# EAGLE design diff-probe (EAGLE 7.2.0)
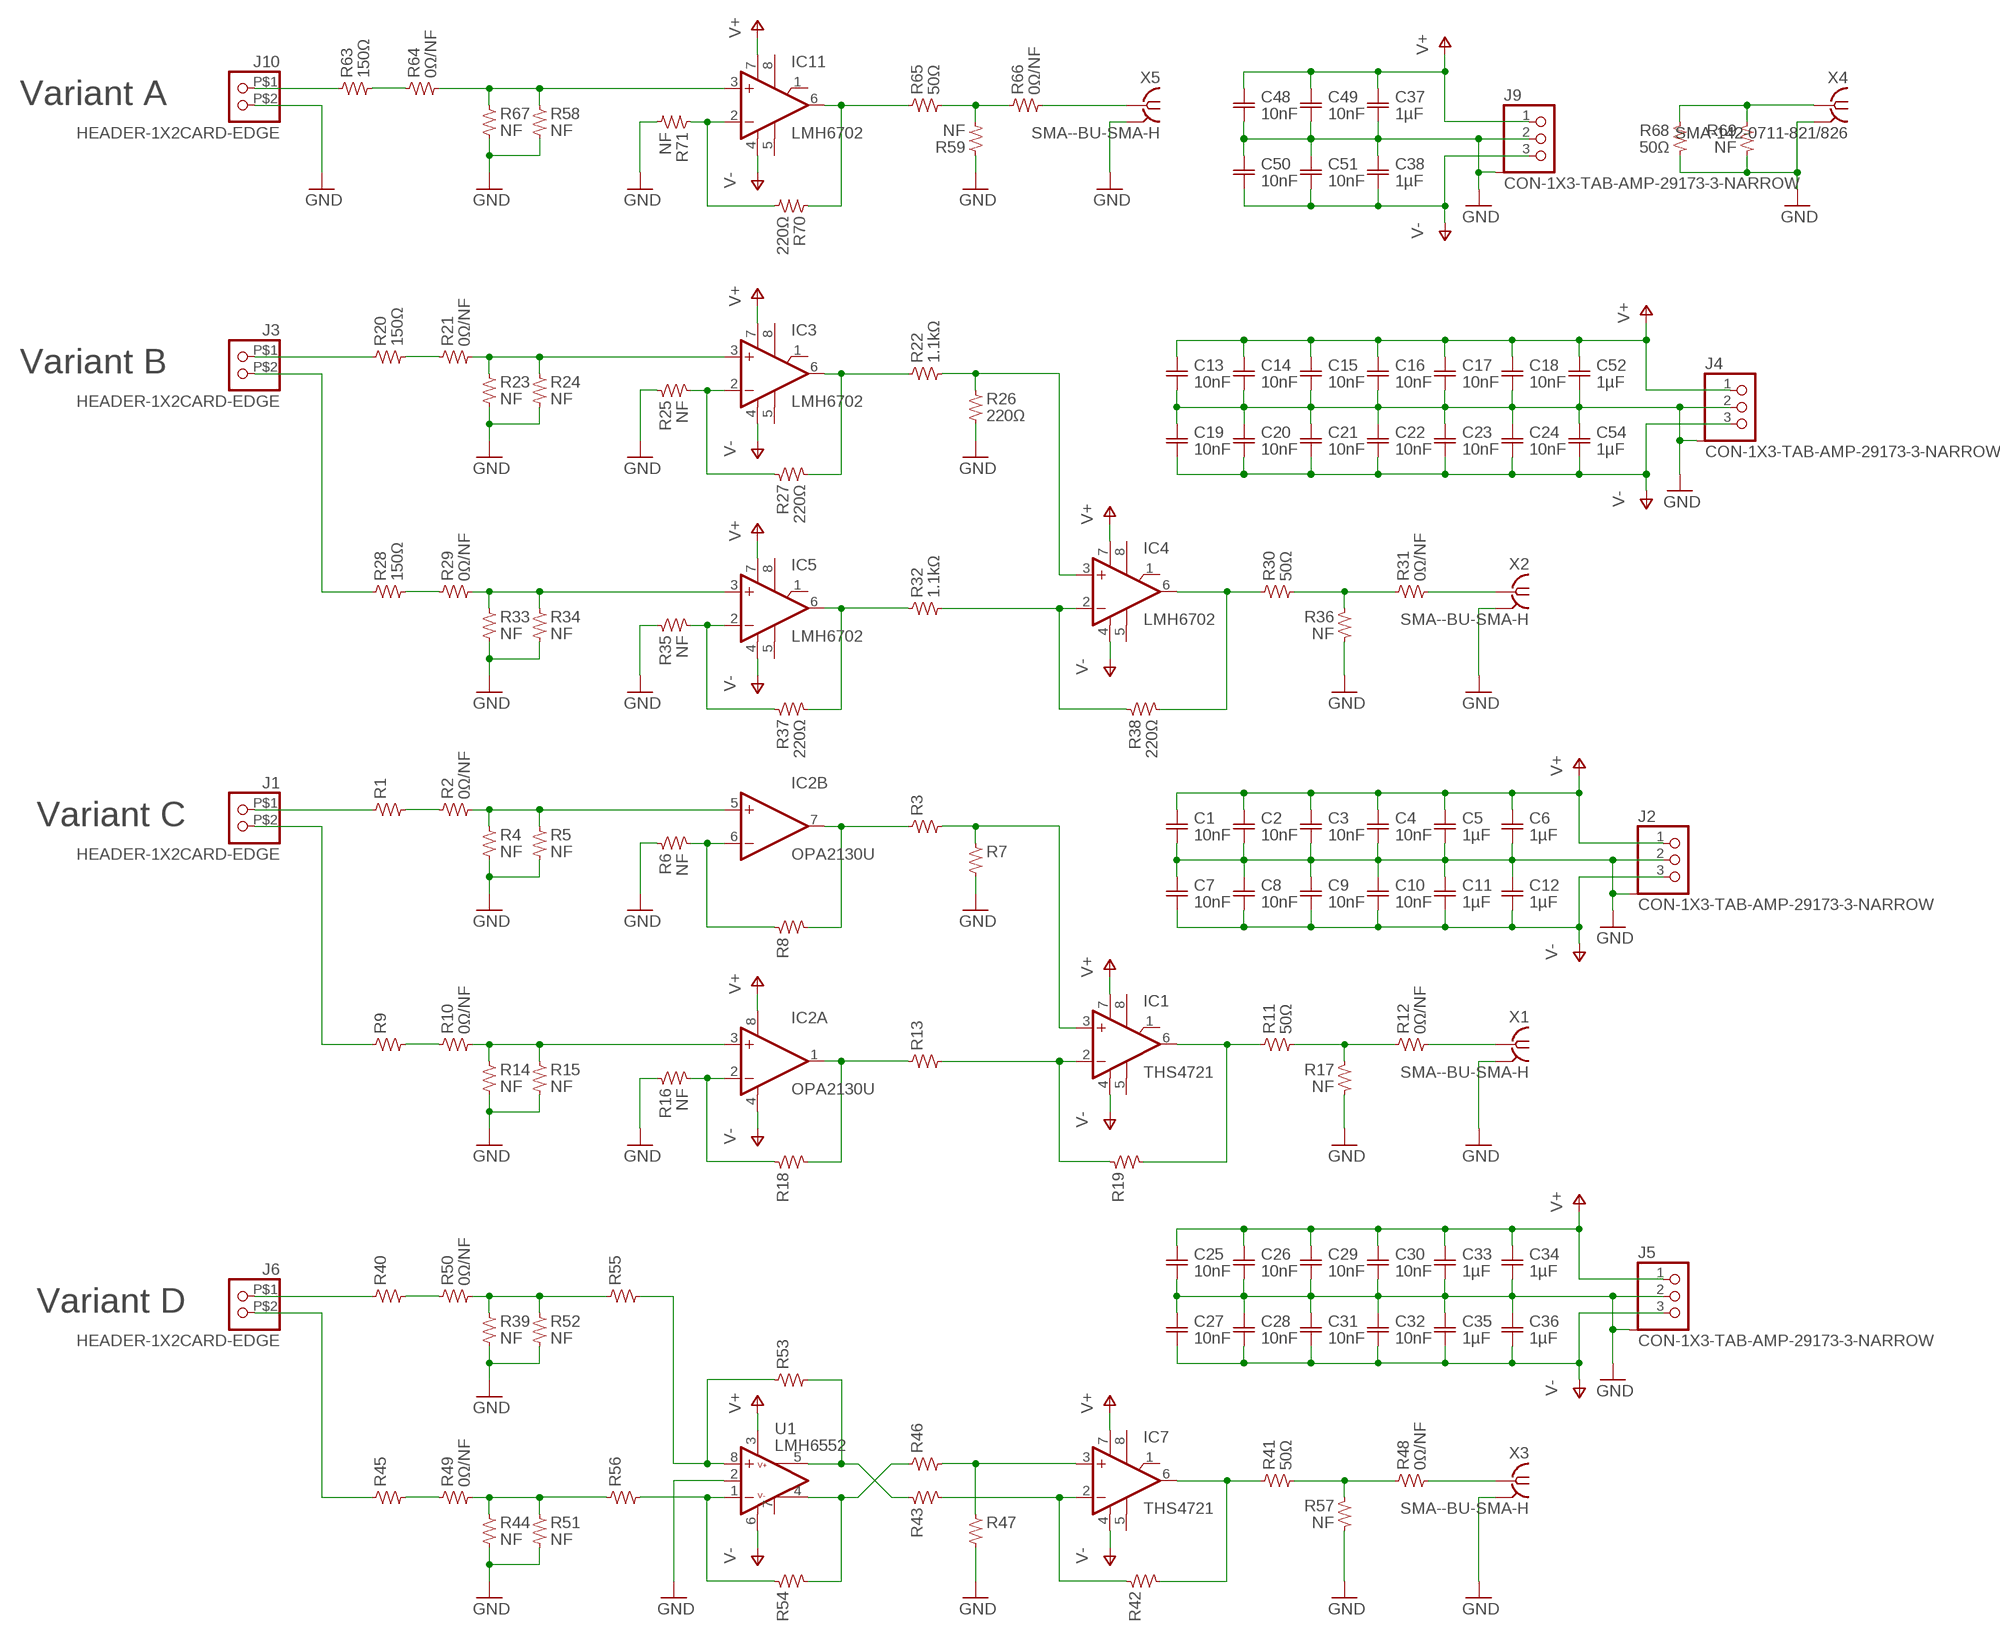
[diagram p0: schematic, sheet 1]

## Parts
C1  10nF  C-EU-0402-SQUARE  [0402-SQUARE]
C2  10nF  C-EU-0402-SQUARE  [0402-SQUARE]
C3  10nF  C-EU-0402-SQUARE  [0402-SQUARE]
C4  10nF  C-EU-0402-SQUARE  [0402-SQUARE]
C5  1µF  C-EU-0603-SQUARE  [0603-SQUARE]
C6  1µF  C-EU-0603-SQUARE  [0603-SQUARE]
C7  10nF  C-EU-0402-SQUARE  [0402-SQUARE]
C8  10nF  C-EU-0402-SQUARE  [0402-SQUARE]
C9  10nF  C-EU-0402-SQUARE  [0402-SQUARE]
C10  10nF  C-EU-0402-SQUARE  [0402-SQUARE]
C11  1µF  C-EU-0603-SQUARE  [0603-SQUARE]
C12  1µF  C-EU-0603-SQUARE  [0603-SQUARE]
C13  10nF  C-EU-0402-SQUARE  [0402-SQUARE]
C14  10nF  C-EU-0402-SQUARE  [0402-SQUARE]
C15  10nF  C-EU-0402-SQUARE  [0402-SQUARE]
C16  10nF  C-EU-0402-SQUARE  [0402-SQUARE]
C17  10nF  C-EU-0402-SQUARE  [0402-SQUARE]
C18  10nF  C-EU-0402-SQUARE  [0402-SQUARE]
C19  10nF  C-EU-0402-SQUARE  [0402-SQUARE]
C20  10nF  C-EU-0402-SQUARE  [0402-SQUARE]
C21  10nF  C-EU-0402-SQUARE  [0402-SQUARE]
C22  10nF  C-EU-0402-SQUARE  [0402-SQUARE]
C23  10nF  C-EU-0402-SQUARE  [0402-SQUARE]
C24  10nF  C-EU-0402-SQUARE  [0402-SQUARE]
C25  10nF  C-EU-0402-SQUARE  [0402-SQUARE]
C26  10nF  C-EU-0402-SQUARE  [0402-SQUARE]
C27  10nF  C-EU-0402-SQUARE  [0402-SQUARE]
C28  10nF  C-EU-0402-SQUARE  [0402-SQUARE]
C29  10nF  C-EU-0402-SQUARE  [0402-SQUARE]
C30  10nF  C-EU-0402-SQUARE  [0402-SQUARE]
C31  10nF  C-EU-0402-SQUARE  [0402-SQUARE]
C32  10nF  C-EU-0402-SQUARE  [0402-SQUARE]
C33  1µF  C-EU-0603-SQUARE  [0603-SQUARE]
C34  1µF  C-EU-0603-SQUARE  [0603-SQUARE]
C35  1µF  C-EU-0603-SQUARE  [0603-SQUARE]
C36  1µF  C-EU-0603-SQUARE  [0603-SQUARE]
C37  1µF  C-EU-0603-SQUARE  [0603-SQUARE]
C38  1µF  C-EU-0603-SQUARE  [0603-SQUARE]
C48  10nF  C-EU-0402-SQUARE  [0402-SQUARE]
C49  10nF  C-EU-0402-SQUARE  [0402-SQUARE]
C50  10nF  C-EU-0402-SQUARE  [0402-SQUARE]
C51  10nF  C-EU-0402-SQUARE  [0402-SQUARE]
C52  1µF  C-EU-0603  [0603]
C54  1µF  C-EU-0603  [0603]
IC1  THS4721  OP-AMP-8-TI  [SO08]
IC2  OPA2130U  [SO08]
IC3  LMH6702  OP-AMP-8-TI  [SO08]
IC4  LMH6702  OP-AMP-8-TI  [SO08]
IC5  LMH6702  OP-AMP-8-TI  [SO08]
IC7  THS4721  OP-AMP-8-TI  [SO08]
IC11  LMH6702  OP-AMP-8-TI  [SO08]
J1  HEADER-1X2CARD-EDGE  [CARD_EDGE_PADS-1X2]
J2  CON-1X3-TAB-AMP-29173-3-NARROW  [AMP-29173-3-NARROW]
J3  HEADER-1X2CARD-EDGE  [CARD_EDGE_PADS-1X2]
J4  CON-1X3-TAB-AMP-29173-3-NARROW  [AMP-29173-3-NARROW]
J5  CON-1X3-TAB-AMP-29173-3-NARROW  [AMP-29173-3-NARROW]
J6  HEADER-1X2CARD-EDGE  [CARD_EDGE_PADS-1X2]
J9  CON-1X3-TAB-AMP-29173-3-NARROW  [AMP-29173-3-NARROW]
J10  HEADER-1X2CARD-EDGE  [CARD_EDGE_PADS-1X2]
R1  R-US-0402-SQUARE  [0402-SQUARE]
R2  0Ω/NF  R-US-0402-SQUARE  [0402-SQUARE]
R3  R-US-0402-SQUARE  [0402-SQUARE]
R4  NF  R-US-0402-SQUARE  [0402-SQUARE]
R5  NF  R-US-0402-SQUARE  [0402-SQUARE]
R6  NF  R-US-0402-SQUARE  [0402-SQUARE]
R7  R-US-0402-SQUARE  [0402-SQUARE]
R8  R-US-0402-SQUARE  [0402-SQUARE]
R9  R-US-0402-SQUARE  [0402-SQUARE]
R10  0Ω/NF  R-US-0402-SQUARE  [0402-SQUARE]
R11  50Ω  R-US-0402-SQUARE  [0402-SQUARE]
R12  0Ω/NF  R-US-0402-SQUARE  [0402-SQUARE]
R13  R-US-0402-SQUARE  [0402-SQUARE]
R14  NF  R-US-0402-SQUARE  [0402-SQUARE]
R15  NF  R-US-0402-SQUARE  [0402-SQUARE]
R16  NF  R-US-0402-SQUARE  [0402-SQUARE]
R17  NF  R-US-0402-SQUARE  [0402-SQUARE]
R18  R-US-0402-SQUARE  [0402-SQUARE]
R19  R-US-0402-SQUARE  [0402-SQUARE]
R20  150Ω  R-US-0402-SQUARE  [0402-SQUARE]
R21  0Ω/NF  R-US-0402-SQUARE  [0402-SQUARE]
R22  1.1kΩ  R-US-0402-SQUARE  [0402-SQUARE]
R23  NF  R-US-0402-SQUARE  [0402-SQUARE]
R24  NF  R-US-0402-SQUARE  [0402-SQUARE]
R25  NF  R-US-0402-SQUARE  [0402-SQUARE]
R26  220Ω  R-US-0402-SQUARE  [0402-SQUARE]
R27  220Ω  R-US-0402-SQUARE  [0402-SQUARE]
R28  150Ω  R-US-0402-SQUARE  [0402-SQUARE]
R29  0Ω/NF  R-US-0402-SQUARE  [0402-SQUARE]
R30  50Ω  R-US-0402-SQUARE  [0402-SQUARE]
R31  0Ω/NF  R-US-0402-SQUARE  [0402-SQUARE]
R32  1.1kΩ  R-US-0402-SQUARE  [0402-SQUARE]
R33  NF  R-US-0402-SQUARE  [0402-SQUARE]
R34  NF  R-US-0402-SQUARE  [0402-SQUARE]
R35  NF  R-US-0402-SQUARE  [0402-SQUARE]
R36  NF  R-US-0402-SQUARE  [0402-SQUARE]
R37  220Ω  R-US-0402-SQUARE  [0402-SQUARE]
R38  220Ω  R-US-0402-SQUARE  [0402-SQUARE]
R39  NF  R-US-0402-SQUARE  [0402-SQUARE]
R40  R-US-0402-SQUARE  [0402-SQUARE]
R41  50Ω  R-US-0402-SQUARE  [0402-SQUARE]
R42  R-US-0402-SQUARE  [0402-SQUARE]
R43  R-US-0402-SQUARE  [0402-SQUARE]
R44  NF  R-US-0402-SQUARE  [0402-SQUARE]
R45  R-US-0402-SQUARE  [0402-SQUARE]
R46  R-US-0402-SQUARE  [0402-SQUARE]
R47  R-US-0402-SQUARE  [0402-SQUARE]
R48  0Ω/NF  R-US-0402-SQUARE  [0402-SQUARE]
R49  0Ω/NF  R-US-0402-SQUARE  [0402-SQUARE]
R50  0Ω/NF  R-US-0402-SQUARE  [0402-SQUARE]
R51  NF  R-US-0402-SQUARE  [0402-SQUARE]
R52  NF  R-US-0402-SQUARE  [0402-SQUARE]
R53  R-US-0402-SQUARE  [0402-SQUARE]
R54  R-US-0402-SQUARE  [0402-SQUARE]
R55  R-US-0402-SQUARE  [0402-SQUARE]
R56  R-US-0402-SQUARE  [0402-SQUARE]
R57  NF  R-US-0402-SQUARE  [0402-SQUARE]
R58  NF  R-US-0402-SQUARE  [0402-SQUARE]
R59  NF  R-US-0402-SQUARE  [0402-SQUARE]
R63  150Ω  R-US-0402-SQUARE  [0402-SQUARE]
R64  0Ω/NF  R-US-0402-SQUARE  [0402-SQUARE]
R65  50Ω  R-US-0402-SQUARE  [0402-SQUARE]
R66  0Ω/NF  R-US-0402-SQUARE  [0402-SQUARE]
R67  NF  R-US-0402-SQUARE  [0402-SQUARE]
R68  50Ω  R-US-0402-SQUARE  [0402-SQUARE]
R69  NF  R-US-0603-SQUARE  [0603-SQUARE]
R70  220Ω  R-US-0402-SQUARE  [0402-SQUARE]
R71  NF  R-US-0402-SQUARE  [0402-SQUARE]
U1  LMH6552  [SO08]
X1  SMA--BU-SMA-H  [BU-SMA-H]
X2  SMA--BU-SMA-H  [BU-SMA-H]
X3  SMA--BU-SMA-H  [BU-SMA-H]
X4  SMA-142-0711-821/826  [J502-ND-142-0711-821/826]
X5  SMA--BU-SMA-H  [BU-SMA-H]

## Nets
GND: C1.P$2 C2.P$2 C3.P$2 C4.P$2 C5.2 C6.2 C7.P$1 C8.P$1 C9.P$1 C10.P$1 C11.1 C12.1 C13.P$2 C14.P$2 C15.P$2 C16.P$2 C17.P$2 C18.P$2 C19.P$1 C20.P$1 C21.P$1 C22.P$1 C23.P$1 C24.P$1 C25.P$2 C26.P$2 C27.P$1 C28.P$1 C29.P$2 C30.P$2 C31.P$1 C32.P$1 C33.2 C34.2 C35.1 C36.1 C37.2 C38.1 C48.P$2 C49.P$2 C50.P$1 C51.P$1 C52.2 C54.1 J2.2 J2.P$4 J2.P$5 J4.2 J4.P$4 J4.P$5 J5.2 J5.P$4 J5.P$5 J9.2 J9.P$4 J9.P$5 J10.P$2 R4.P$2 R5.P$2 R6.P$1 R7.P$2 R14.P$2 R15.P$2 R16.P$1 R17.P$2 R23.P$2 R24.P$2 R25.P$1 R26.P$2 R33.P$2 R34.P$2 R35.P$1 R36.P$2 R39.P$2 R44.P$2 R47.P$2 R51.P$2 R52.P$2 R57.P$2 R58.P$2 R59.P$1 R67.P$2 R68.P$2 R69.2 R71.P$2 U1.2(VCM) X1.2 X1.3 X1.4 X1.5 X2.2 X2.3 X2.4 X2.5 X3.2 X3.3 X3.4 X3.5 X4.G@1 X4.G@2 X4.G@3 X4.G@4 X5.2 X5.3 X5.4 X5.5
N$1: IC11.3(+IN) R58.P$1 R64.P$2 R67.P$1
N$2: R63.P$2 R64.P$1
N$3: J10.P$1 R63.P$1
N$5: R59.P$2 R65.P$2 R66.P$1
N$6: IC11.6(OUT) R65.P$1 R70.P$1
N$7: R66.P$2 X5.1
N$8: R53.P$1 R55.P$2 U1.8(+IN)
N$9: R40.P$2 R50.P$1
N$10: R43.P$1 R53.P$2 U1.5(-OUT)
N$11: R41.P$2 R48.P$1 R57.P$1
N$12: IC7.6(OUT) R41.P$1 R42.P$2
N$13: IC7.2(-IN) R42.P$1 R43.P$2
N$14: R39.P$1 R50.P$2 R52.P$1 R55.P$1
N$15: R45.P$2 R49.P$1
N$16: R46.P$1 R54.P$2 U1.4(+OUT)
N$17: IC7.3(+IN) R46.P$2 R47.P$1
N$18: J6.P$1 R40.P$1
N$19: J6.P$2 R45.P$1
N$20: R48.P$2 X3.1
N$21: R54.P$1 R56.P$2 U1.1(-IN)
N$22: R44.P$1 R49.P$2 R51.P$1 R56.P$1
N$25: IC11.2(-IN) R70.P$2 R71.P$1
N$30: R68.P$1 R69.1 X4.1
N$31: IC2.5(B:+IN) R2.P$2 R4.P$1 R5.P$1
N$35: R1.P$2 R2.P$1
N$36: IC2.7(B:OUT) R3.P$1 R8.P$2
N$37: IC3.3(+IN) R21.P$2 R23.P$1 R24.P$1
N$38: R20.P$2 R21.P$1
N$39: IC3.6(OUT) R22.P$1 R27.P$2
N$40: R11.P$2 R12.P$1 R17.P$1
N$41: R30.P$2 R31.P$1 R36.P$1
N$43: IC4.6(OUT) R30.P$1 R38.P$2
N$44: IC4.2(-IN) R32.P$2 R38.P$1
N$45: IC5.3(+IN) R29.P$2 R33.P$1 R34.P$1
N$46: R28.P$2 R29.P$1
N$47: R12.P$2 X1.1
N$48: IC5.6(OUT) R32.P$1 R37.P$2
N$49: IC4.3(+IN) R22.P$2 R26.P$1
N$50: J3.P$1 R20.P$1
N$51: J3.P$2 R28.P$1
N$52: IC1.6(OUT) R11.P$1 R19.P$2
N$53: IC1.2(-IN) R13.P$2 R19.P$1
N$54: IC2.3(A:+IN) R10.P$2 R14.P$1 R15.P$1
N$55: R9.P$2 R10.P$1
N$56: IC2.1(A:OUT) R13.P$1 R18.P$2
N$57: IC1.3(+IN) R3.P$2 R7.P$1
N$58: J1.P$1 R1.P$1
N$59: J1.P$2 R9.P$1
N$60: IC2.2(A:-IN) R16.P$2 R18.P$1
N$61: R31.P$2 X2.1
N$62: IC2.6(B:-IN) R6.P$2 R8.P$1
N$63: IC5.2(-IN) R35.P$2 R37.P$1
N$64: IC3.2(-IN) R25.P$2 R27.P$1
V+: C1.P$1 C2.P$1 C3.P$1 C4.P$1 C5.1 C6.1 C13.P$1 C14.P$1 C15.P$1 C16.P$1 C17.P$1 C18.P$1 C25.P$1 C26.P$1 C29.P$1 C30.P$1 C33.1 C34.1 C37.1 C48.P$1 C49.P$1 C52.1 IC1.7(+VS1) IC2.8(A:V+) IC3.7(+VS1) IC4.7(+VS1) IC5.7(+VS1) IC7.7(+VS1) IC11.7(+VS1) J2.1 J4.1 J5.1 J9.1 U1.3(V+)
V-: C7.P$2 C8.P$2 C9.P$2 C10.P$2 C11.2 C12.2 C19.P$2 C20.P$2 C21.P$2 C22.P$2 C23.P$2 C24.P$2 C27.P$2 C28.P$2 C31.P$2 C32.P$2 C35.2 C36.2 C38.2 C50.P$2 C51.P$2 C54.2 IC1.4(-VS1) IC2.4(A:V-) IC3.4(-VS1) IC4.4(-VS1) IC5.4(-VS1) IC7.4(-VS1) IC11.4(-VS1) J2.3 J4.3 J5.3 J9.3 U1.6(V-)
Unconnected: IC1.1(C) IC1.5(-VS2) IC1.8(A) IC3.1(C) IC3.5(-VS2) IC3.8(A) IC4.1(C) IC4.5(-VS2) IC4.8(A) IC5.1(C) IC5.5(-VS2) IC5.8(A) IC7.1(C) IC7.5(-VS2) IC7.8(A) IC11.1(C) IC11.5(-VS2) IC11.8(A) U1.7(EN)

## Notes on the sheet
- Variant A
- Variant B
- Variant C
- Variant D

## Library data of the parts
C1-C38 C48-C52 C54 = wingel:C-EU
IC1 IC3-IC5 IC7 IC11 = wingel:OP-AMP-8: Operational Amplifier; MPN: AD9631ARZ; OC_FARNELL: 1319480; OC_NEWARK: 19M8943
IC2 = burr-brown:OPA2130: Operational Amplifier; MF: TEXAS INSTRUMENTS; MPN: OPA2130UA; OC_FARNELL: 1459554; OC_NEWARK: 35C1841
J1 J3 J6 J10 = wingel:HEADER-1X2
J2 J4 J5 J9 = wingel:CON-1X3-TAB
R1-R59 R63-R71 = wingel:R-US
U1 = wingel:LMH6552
X1-X3 X5 = wingel:SMA-: SMA 50 Ohm End Launch Jack Receptacle - Round Contact Johnson Components Source: www.johnsoncomponents.com .. J502-ND.pdf
X4 = wingel:SMA-: SMA 50 Ohm End Launch Jack Receptacle - Round Contact Johnson Components Source: www.johnsoncomponents.com .. J502-ND.pdf; MF: JOHNSON COMPONENTS; MPN: 142-0711-821; OC_FARNELL: 1019328; OC_NEWARK: 16F3627

## Board
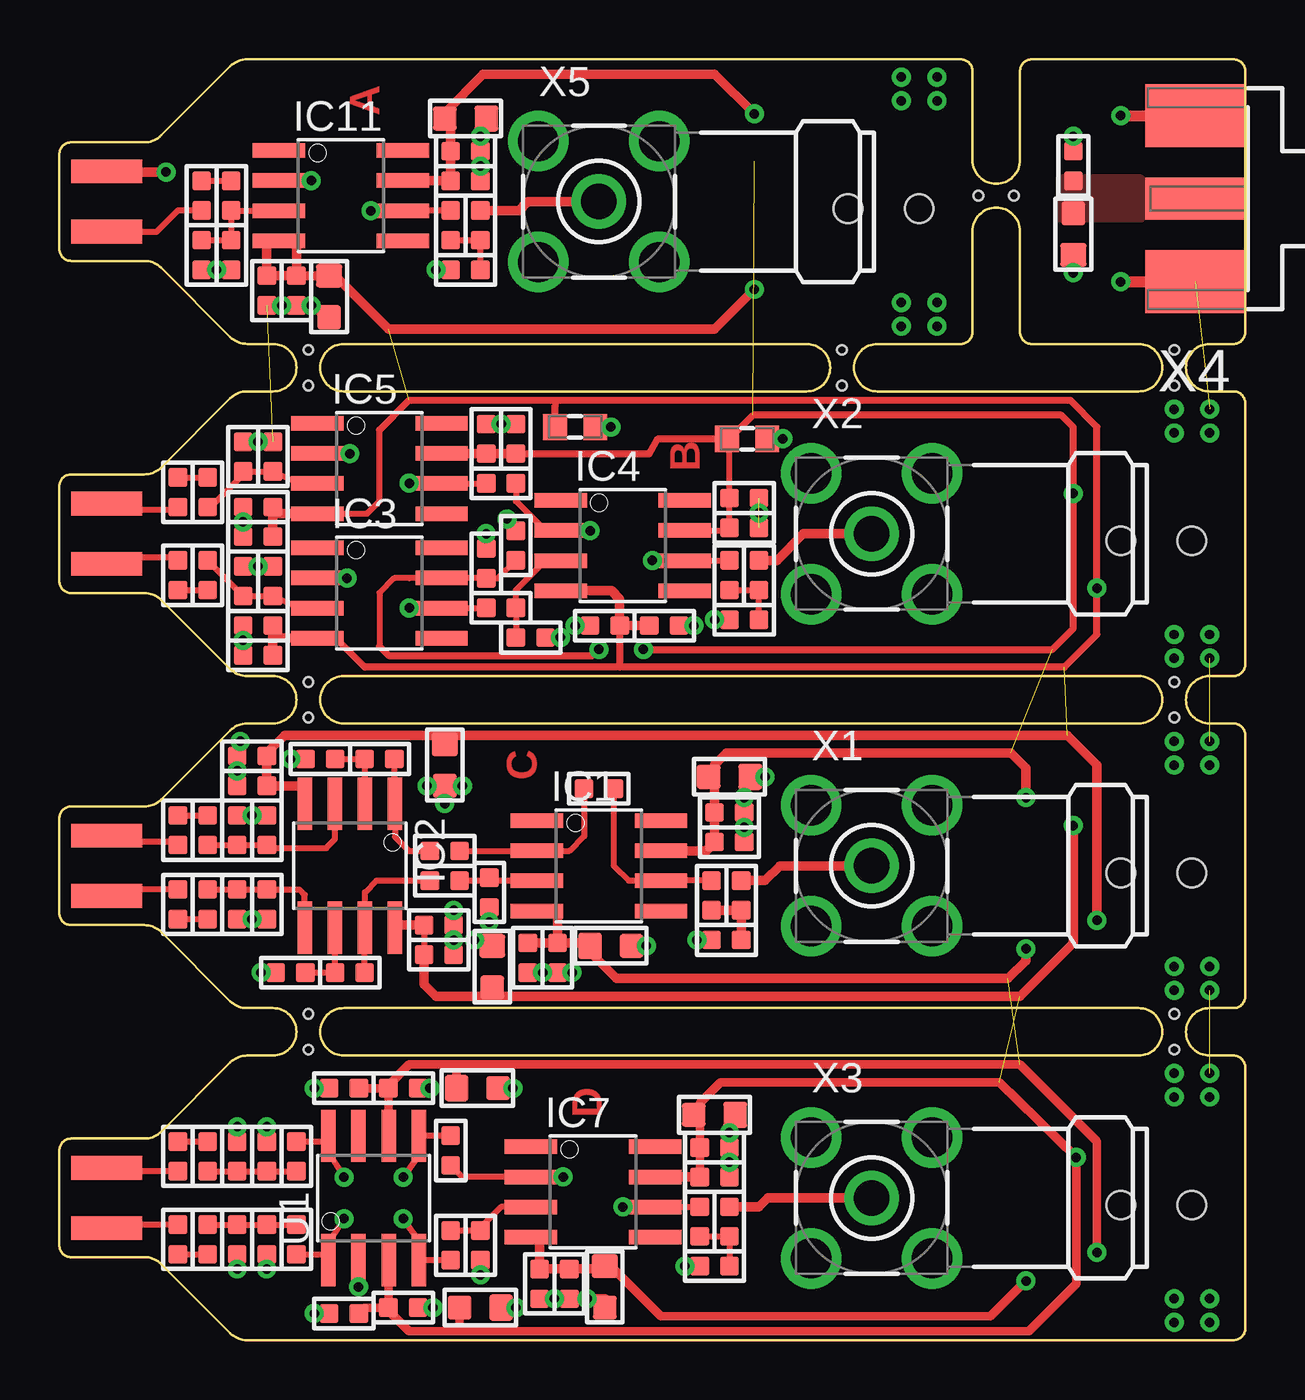
[diagram p1: board, top side]
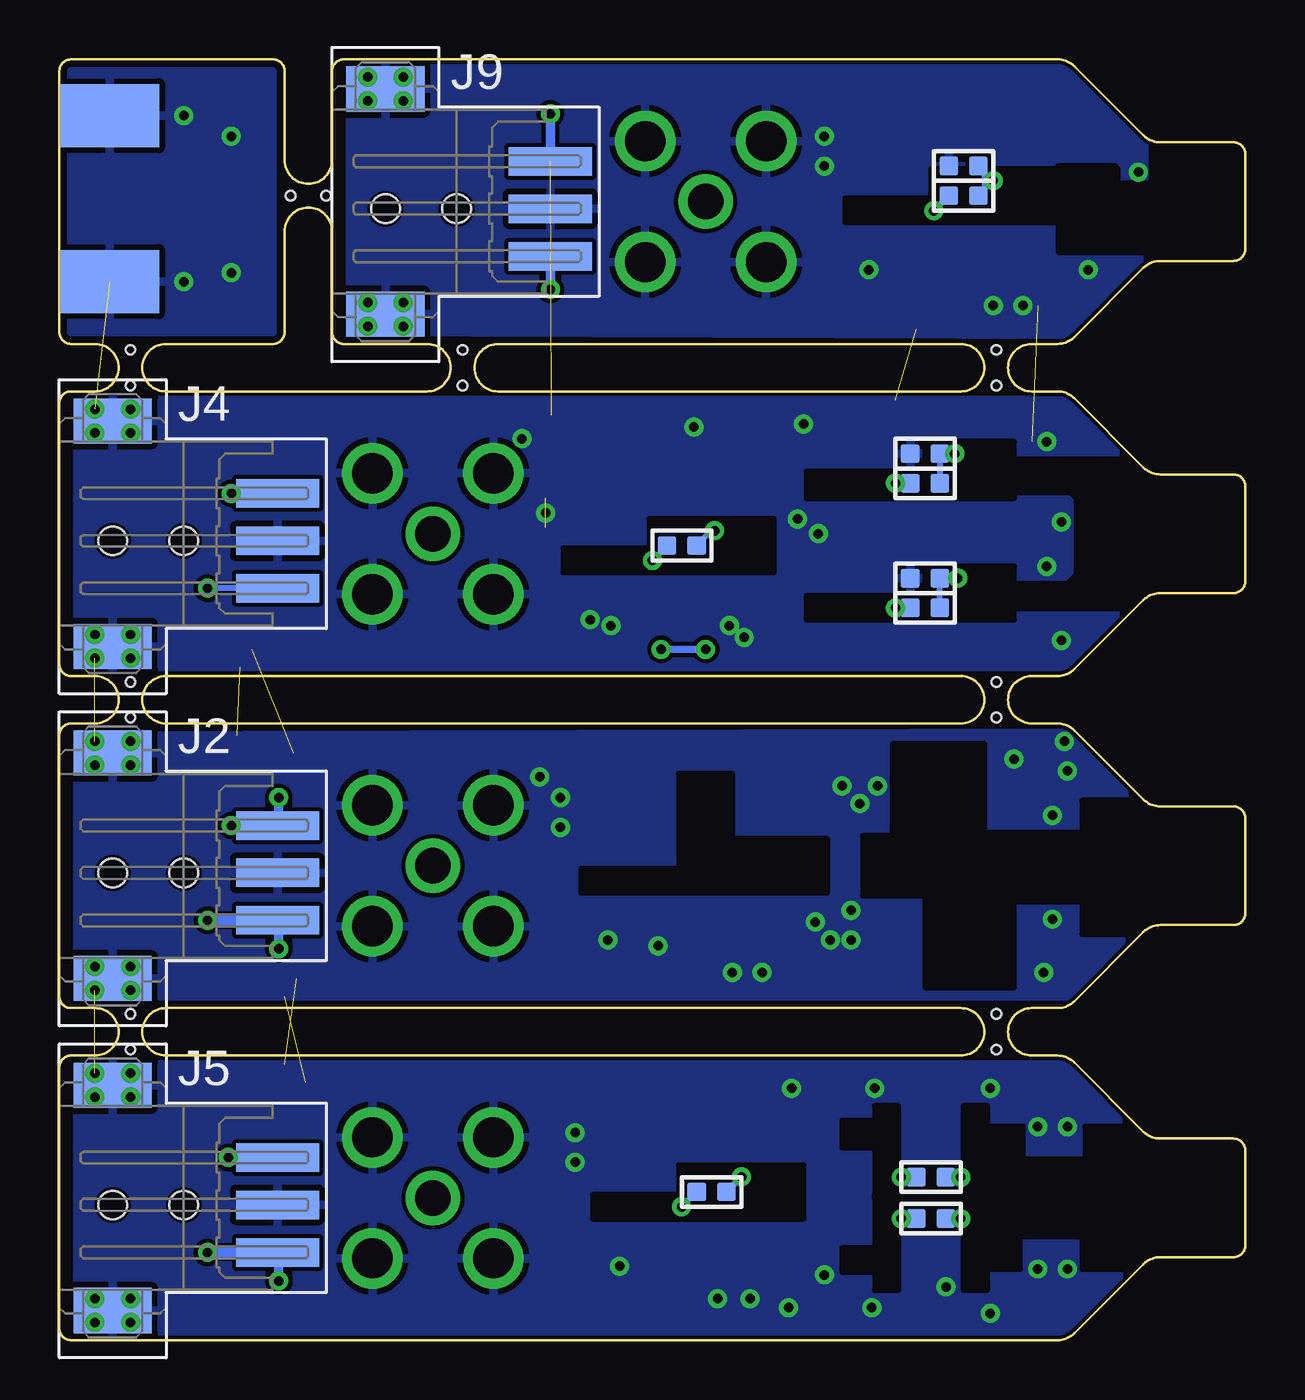
[diagram p2: board, bottom side, seen from below]

Size 50 x 54 mm. Coordinates in mm from the lower left corner, seen from the top.
Outline: 50,39.5 arc90 49.5,40 48.5,40 arc-180 48.5,42 49.5,42 arc90 50,42.5 50,53.5 arc90 49.5,54 41,54 arc90 40.5,53.5 40.5,49.75 arc-180 38.5,49.75 38.5,53.5 arc90 38,54 7.91,54 arc45 7.21,53.71 4.29,50.79 arc-45 3.59,50.5 0.5,50.5 arc90 0,50 0,46 arc90 0.5,45.5 3.59,45.5 arc-45 4.29,45.21 7.21,42.29 arc45 7.91,42 9,42 arc-180 9,40 7.91,40 arc45 7.21,39.71 4.29,36.79 arc-45 3.59,36.5 0.5,36.5 arc90 0,36 0,32 arc90 0.5,31.5 3.59,31.5 arc-45 4.29,31.21 7.21,28.29 arc45 7.91,28 9,28 arc-180 9,26 7.91,26 arc45 7.21,25.71 4.29,22.79 arc-45 3.59,22.5 0.5,22.5 arc90 0,22 0,18 arc90 0.5,17.5 3.59,17.5 arc-45 4.29,17.21 7.21,14.29 arc45 7.91,14 9,14 arc-180 9,12 7.91,12 arc45 7.21,11.71 4.29,8.79 arc-45 3.59,8.5 0.5,8.5 arc90 0,8 0,4 arc90 0.5,3.5 3.59,3.5 arc-45 4.29,3.21 7.21,0.29 arc45 7.91,0 49.5,0 arc90 50,0.5 50,11.5 arc90 49.5,12 48.5,12 arc-180 48.5,14 49.5,14 arc90 50,14.5 50,25.5 arc90 49.5,26 48.5,26 arc-180 48.5,28 49.5,28 arc90 50,28.5 50,39.5
Copper layers (1*16): Top 0.035mm / dielectric 1.5mm / Bottom 0.035mm
Design rules "tight *": minimum track width 6mil, minimum drill 0.3mm, track to track 7mil, track to pad 7mil, pad to pad 7mil, via to via 7mil, smd to smd 0mil, copper to edge 0.15mm, drill to drill 10mil, minimum pad ring 10mil, minimum via ring 6mil, stop-mask expansion 2mil, vias tented up to drill 100mil, thermal gap 10mil
Holes 0.4 mm at 10.5,13.75 10.5,12.25 47,13.75 47,12.25 10.5,27.75 10.5,26.25 10.5,41.75 10.5,40.25 47,27.75 47,26.25 47,41.75 47,40.25 38.75,48.25 40.25,48.25 33,40.25 33,41.75
bRestrict: area 9.8,35.5 to 18.5,37.9; area 9.8,30.4 to 18.5,32.6; area 19.9,32.4 to 28.8,34.6; area 17.6,18.9 to 28,23.9; area 4.1,14.9 to 16.1,25.1; area 18.6,5.1 to 27.5,7.4; area 0.1,6.1 to 17,9.9; area 0.1,2.1 to 17,6; area 0,45.9 to 16.9,49.5; area 0,30.9 to 9.5,37.1
Milling: 23 lines

### Footprints (pad centres in the part's own frame; a part is rotated, then mirrored left to right if it is on the bottom)
0402-SQUARE = smd 0.8 x 0.8: P$1 -0.625,0; P$2 0.625,0
0603-SQUARE = smd 1 x 1: 1 -0.875,0 | smd 1 x 1.1: 2 0.875,0
0603 = smd 1 x 1.1: 1 -0.85,0; 2 0.85,0
SO08 = smd 0.61 x 2.21: 1 -1.905,-2.616; 2 -0.635,-2.616; 3 0.635,-2.616; 4 1.905,-2.616; 5 1.905,2.616; 6 0.635,2.616; 7 -0.635,2.616; 8 -1.905,2.616
CARD_EDGE_PADS-1X2 = smd 1 x 3: P$1 -1.27,0; P$2 1.27,0
AMP-29173-3-NARROW = smd 1.2 x 3.5: 1 -1.7,9.2; 2 0.3,9.2; 3 2.3,9.2 | smd 1.9 x 3.3: P$4 4.75,2.25; P$5 -4.75,2.25 | hole 1.2: 0.3,2.25; 0.3,5.25
BU-SMA-H = drill 1.5 pad 2.3: 1 0,0 | drill 1.7 pad 2.5: 2 -2.55,2.55; 3 2.55,2.55; 4 2.55,-2.55; 5 -2.55,-2.55
J502-ND-142-0711-821/826 = smd 4.191 x 1.778: 1 2.115,0 | smd 4.191 x 2.667: G@1 2.115,3.495; G@2 2.115,-3.495 | smd 4.191 x 2.667 bottom: G@3 2.115,3.495; G@4 2.115,-3.495

### Placement (x,y rotation side)
C1  16,16.25 0 top
C2  16,17.5 0 top
C3  28.25,22.25 0 top
C4  28.25,21 0 top
C5  28.25,23.75 0 top
C6  18.25,15.75 90 top
C7  8.12,24.62 0 top
C8  8.12,23.38 0 top
C9  19.75,16.12 90 top
C10  21,16.12 90 top
C11  23.25,16.62 180 top
C12  16.25,24.25 90 top
C13  18,38 90 top
C14  19.25,38 90 top
C15  19.25,33.5 90 top
C16  18,32.75 90 top
C17  28.88,35.5 0 top
C18  28.88,34.25 0 top
C19  8.38,35.12 0 top
C20  8.38,33.88 0 top
C21  8.38,30.12 0 top
C22  8.38,28.88 0 top
C23  23,30.12 0 top
C24  25.5,30.12 180 top
C25  12,1.12 180 top
C26  14.5,1.38 0 top
C27  12,10.62 0 top
C28  14.5,10.62 180 top
C29  27.62,6.88 0 top
C30  27.62,8.12 0 top
C31  20.25,2.38 90 top
C32  21.5,2.38 90 top
C33  27.62,9.5 0 top
C34  17.75,1.38 0 top
C35  23,2.25 90 top
C36  17.62,10.62 180 top
C37  17.12,51.5 0 top
C38  11.38,44 90 top
C48  17.12,50.12 0 top
C49  17.12,48.88 0 top
C50  10,44.25 90 top
C51  8.75,44.25 90 top
C52  29,38 0 top
C54  21.75,38.5 180 top
IC1  22.75,20 270 top
IC2  12.25,20 180 top
IC3  13.5,31.5 270 top
IC4  23.75,33.5 270 top
IC5  13.5,36.75 270 top
IC7  22.5,6.25 270 top
IC11  11.88,48.25 270 top
J1  2,20 90 top
J2  50,20 270 bottom
J3  2,34 90 top
J4  50,34 270 bottom
J5  50,6 270 bottom
J6  2,6 270 top
J9  38.5,48 270 bottom
J10  2,48 90 top
R1  5,18.38 270 top
R2  6.25,18.38 90 top
R3  16.25,19.38 0 top
R4  7.5,18.38 270 top
R5  8.75,18.38 270 top
R6  9.75,15.5 0 top
R7  18.12,18.88 270 top
R8  12.25,15.5 0 top
R9  5,21.5 90 top
R10  6.25,21.5 270 top
R11  27.5,18.75 270 top
R12  28.75,18.75 90 top
R13  16.25,20.62 0 top
R14  7.5,21.5 90 top
R15  8.75,21.5 90 top
R16  11,24.5 0 top
R17  28.12,16.88 180 top
R18  13.5,24.5 0 top
R19  22.75,23.25 0 top
R20  5,32.25 270 top
R21  6.25,32.25 90 top
R22  18.62,30.88 0 top
R23  7.75,32 90 top
R24  9,32 90 top
R25  13.5,32.12 0 bottom
R26  19.88,29.62 0 top
R27  13.5,30.88 180 bottom
R28  5,35.75 90 top
R29  6.25,35.75 270 top
R30  28.25,32.25 270 top
R31  29.5,32.25 90 top
R32  18.62,36.12 0 top
R33  7.75,37.25 90 top
R34  9,37.25 90 top
R35  13.5,37.38 0 bottom
R36  28.88,30.38 180 top
R37  13.5,36.12 180 bottom
R38  23.75,33.5 180 bottom
R39  7.5,7.75 90 top
R40  5,7.75 90 top
R41  27,5 270 top
R42  22.5,6.25 180 bottom
R43  16.5,8 270 top
R44  7.5,4.25 270 top
R45  5,4.25 270 top
R46  16.5,4 90 top
R47  17.75,4 270 top
R48  28.25,5 90 top
R49  6.25,4.25 90 top
R50  6.25,7.75 270 top
R51  8.75,4.25 270 top
R52  8.75,7.75 90 top
R53  13.25,6.88 180 bottom
R54  13.25,5.12 180 bottom
R55  10,7.75 90 top
R56  10,4.25 270 top
R57  27.62,3.12 180 top
R58  7.25,45.75 270 top
R59  17.12,45.12 0 top
R63  6,48.25 90 top
R64  7.25,48.25 270 top
R65  16.5,47 270 top
R66  17.75,47 90 top
R67  6,45.75 270 top
R68  42.75,49.5 90 top
R69  42.75,46.62 270 top
R70  11.88,48.25 0 bottom
R71  11.88,49.5 180 bottom
U1  13.25,6 0 top
X1  34.25,20 0 top
X2  34.25,34 0 top
X3  34.25,6 0 top
X4  50,48.12 180 top
X5  22.75,48 0 top

### Tracks (layer width: path | path; a pad name or v marks a point on that pad's centre or on a via)
GND  (via drill 0.4 pad 0.8)  (6 unrouted)
  Top 0.254: R7.P$2 v18.12,17.62 | v7.75,29.5 C22.P$1 | R23.P$2 v8.38,32.62 R24.P$2 | C20.P$1 v7.75,34.5 C19.P$1 | R33.P$2 v8.38,37.88 R34.P$2 | v18,34 C16.P$2 | C23.P$1 v21.75,30.12 | R26.P$2 v21.12,29.62 | C14.P$2 v18.62,38.62 C13.P$2 | v27.62,30.38 R36.P$2 | v26.75,30.12 C24.P$1 | C52.2 v30.5,38 | v7.5,3 R44.P$2 | v8.75,3 R51.P$2 | v7.5,9 R39.P$2 | v8.75,9 R52.P$2 | R68.P$2 v42.75,50.75 | C15.P$2 18.88,34.5 v18.88,34.62 | R57.P$2 v26.38,3.12 | v15.88,45.12 R59.P$1 | R58.P$2 v6.62,45.12 R67.P$2
  Top 0.3: v23.25,38.5 C54.1
  Top 0.4: R14.P$2 v8.12,22.12 R15.P$2 | v8.5,15.5 R6.P$1 | v9.75,24.5 R16.P$1 | C2.P$2 v16.62,16.88 C1.P$2 16.62,16.62 | C7.P$1 v7.62,25.25 | C8.P$1 v7.5,24 | C9.P$1 v20.38,15.5 | C10.P$1 v21.62,15.5 | C4.P$2 v28.88,21.62 | R5.P$2 v8.12,17.75 R4.P$2 | v29.75,23.75 C5.2 28.88,23.75 C3.P$2 | C11.1 v24.75,16.62 | v15.5,23.38 C12.1 | R17.P$2 v26.88,16.88 | 18.25,16.88 C6.2 18.12,16.62 18.12,16.88 v17.5,16.88 | C21.P$1 v7.75,29.5 | v10.75,10.62 C27.P$1 | v10.75,1.12 C25.P$2 | v12.62,2.25 U1.2 | v15.62,10.62 C28.P$1 | C36.1 v19.12,10.62 | v19.25,1.38 C34.2 | C31.P$1 v20.88,1.75 C32.P$1 23,1.75 C35.1 | v15.75,1.38 C26.P$2 | v17.75,2.75 R47.P$2 | C29.P$2 C30.P$2 | C30.P$2 v28.25,8.75 28.25,9.5 C33.2 28.25,9.28 C30.P$2 | C49.P$2 v17.75,49.5 | C48.P$2 v17.75,50.75 17.75,51.5 C37.2 | v10.62,43.62 C50.P$1 C51.P$1 v10.62,43.62 | v10.62,43.62 C38.1 | 47.75,44.62 X4.G@3 | 47.75,51.62 X4.G@4 | v4.5,49.25 2.02,49.25 J10.P$2 | R69.2 v42.75,45
  Top 0.457: v44.75,44.62 47.75,44.62 | v44.75,51.62 47.75,51.62
  Bottom 0.254: v47,29.75 J4.P$4 | v47,28.75 J4.P$4 | v48.5,28.75 v48.5,29.75 J4.P$4 | v47,39.25 J4.P$5 | v48.5,39.25 J4.P$5 | v48.5,38.25 J4.P$5 | v47,38.25 J4.P$5 | v47,0.75 J5.P$4 | v47,1.75 J5.P$4 | v48.5,1.75 J5.P$4 | v48.5,0.75 J5.P$4 | v47,11.25 J5.P$5 | v48.5,11.25 J5.P$5 | v48.5,10.25 J5.P$5 | v47,10.25 J5.P$5
  Bottom 0.4: v47,15.75 J2.P$4 | v48.5,15.75 J2.P$4 | v48.5,14.75 J2.P$4 | v47,14.75 J2.P$4 | v47,25.25 J2.P$5 | v48.5,25.25 J2.P$5 | v48.5,24.25 J2.P$5 | v47,24.25 J2.P$5
  other vias: 28.88,22.88 29.5,34.88 22.25,1.75 28.25,7.5 9.38,43.62 16.62,18.12 17,23.38 16.25,22.62 35.5,52.25 35.5,53.25 37,53.25 37,52.25 35.5,43.75 37,43.75 35.5,42.75 37,42.75
  pour Bottom: 4.62,16.75 7,14.5 49.25,14.5 49.25,25.5 7.12,25.62 4.62,23.12
  pour Bottom: 4.62,30.88 7.12,28.38 49.25,28.38 49.25,39.62 7.12,39.62 4.5,37
  pour Bottom: 4.75,2.75 7.12,0.38 49.25,0.38 49.25,11.62 7.12,11.62 4.62,9.12
  pour Bottom: 4.25,45.25 7.12,42.38 37.75,42.5 37.75,53.62 7.12,53.62 4.25,50.75
  pour Bottom: 49.5,42.5 41,42.5 41,53.5 49.5,53.5
N$1
  Top 0.254: R67.P$1 R58.P$1 R64.P$2 IC11.3
N$2
  Top 0.254: R63.P$2 R64.P$1
N$3
  Top 0.254: J10.P$1 4.11,46.73 5,47.62 R63.P$1
N$5
  Top 0.254: R65.P$2 R66.P$1 R59.P$2
N$6  (via drill 0.4 pad 0.8)
  Top 0.254: v13.13,47.62 IC11.6 R65.P$1 16.62,47.62
  Bottom 0.254: v13.13,47.62 R70.P$1
N$7
  Top 0.4: R66.P$2 19.38,47.62 19.75,48 X5.1
N$8  (via drill 0.4 pad 0.8)
  Top 0.254: v12,6.88 11.35,7.91 U1.8 11.35,8.38 R55.P$2
  Bottom 0.254: v12,6.88 R53.P$1
N$9
  Top 0.254: R40.P$2 R50.P$1
N$10  (via drill 0.4 pad 0.8)
  Top 0.254: v14.5,6.88 15.15,7.78 U1.5 15.16,8.62 R43.P$1
  Bottom 0.254: v14.5,6.88 R53.P$2
N$11
  Top 0.254: R41.P$2 R48.P$1 R57.P$1
N$12  (via drill 0.4 pad 0.8)
  Top 0.254: v23.76,5.62 IC7.6 R41.P$1
  Bottom 0.254: v23.76,5.62 R42.P$2
N$13  (via drill 0.4 pad 0.8)
  Top 0.254: R43.P$2 16.99,6.88 IC7.2 v21.24,6.88
  Bottom 0.254: v21.24,6.88 R42.P$1
N$14
  Top 0.254: R50.P$2 R39.P$1 R52.P$1 R55.P$1
N$15
  Top 0.254: R45.P$2 R49.P$1
N$16  (via drill 0.4 pad 0.8)
  Top 0.254: v14.5,5.12 15.15,4.22 U1.4 15.16,3.38 R46.P$1
  Bottom 0.254: R54.P$2 v14.5,5.12
N$17
  Top 0.254: R46.P$2 R47.P$1 17.75,4.75 18.61,5.62 IC7.3
N$18
  Top 0.254: R40.P$1 2,7.12 J6.P$1
N$19
  Top 0.254: R45.P$1 2.15,4.88 J6.P$2
N$20
  Top 0.4: X3.1 29.88,6 29.5,5.62 R48.P$2
N$21  (via drill 0.4 pad 0.8)
  Top 0.254: R56.P$2 11.35,3.62 U1.1 11.35,4.09 v12,5.12
  Bottom 0.254: R54.P$1 v12,5.12
N$22
  Top 0.254: R49.P$2 R44.P$1 R51.P$1 R56.P$1
N$25  (via drill 0.4 pad 0.8)
  Top 0.254: IC11.2 v10.62,48.88
  Bottom 0.254: v10.62,48.88 11,48.88 | 11,48.88 11,48.25 R70.P$2 | R71.P$1 11,49.5 11,48.88
N$30
  pour Top (no thermals): 48.12,48.88 45.75,48.88 45.62,49 42.12,49 42.12,47.25 45.62,47.25 45.75,47.38 48.12,47.38
N$31
  Top 0.254: R2.P$2 R4.P$1 R5.P$1 10.12,19 10.35,18.78 IC2.5
N$35
  Top 0.254: R1.P$2 R2.P$1
N$36
  Top 0.254: R8.P$2 IC2.7 12.88,18.89 13.38,19.38 R3.P$1
N$37
  Top 0.254: IC3.3 10.13,30.86 R24.P$1 R23.P$1 R21.P$2 6.5,33.12
N$38
  Top 0.254: R20.P$2 R21.P$1
N$39  (via drill 0.4 pad 0.8)
  Top 0.254: v14.75,30.88 16.11,30.88 IC3.6 17.99,30.86 R22.P$1
  Bottom 0.254: R27.P$2 v14.75,30.88
N$40
  Top 0.4: R11.P$2 R12.P$1 R17.P$1
N$41
  Top 0.254: R30.P$2 R31.P$1 R36.P$1
N$43  (via drill 0.4 pad 0.8)
  Top 0.254: v25,32.88 25.01,32.87 IC4.6 28.24,32.87 R30.P$1
  Bottom 0.254: v25,32.88 R38.P$2
N$44  (via drill 0.4 pad 0.8)
  Top 0.254: v22.38,34.12 22.36,34.13 IC4.2 21.02,34.25 20.38,34.25 19.25,35.38 R32.P$2
  Bottom 0.254: v22.38,34.12 22.5,34.12 R38.P$1
N$45
  Top 0.254: IC5.3 10.13,36.12 R34.P$1 R33.P$1 7.62,36.38 6.38,35.12 R29.P$2
N$46
  Top 0.254: R28.P$2 R29.P$1
N$47
  Top 0.4: R12.P$2 29.75,19.38 30.38,20 X1.1
N$48  (via drill 0.4 pad 0.8)
  Top 0.254: v14.75,36.12 v14.76,36.12 IC5.6 17.89,36.12 R32.P$1
  Bottom 0.254: v14.75,36.12 R37.P$2
N$49
  Top 0.254: IC4.3 20.5,32.88 19.25,31.62 R22.P$2 R26.P$1
N$50
  Top 0.254: R20.P$1 4.88,33 3.12,33 2.85,32.73 J3.P$1
N$51
  Top 0.254: R28.P$1 4.88,35 2.75,35 2.48,35.27 J3.P$2
N$52
  Top 0.254: R19.P$2 23.38,20 24.01,19.36 IC1.6 25.38,19.38 R11.P$1
N$53
  Top 0.254: R13.P$2 20.12,20.62 IC1.2 21.51,20.64 22.12,21.25 R19.P$1
N$54
  Top 0.254: R10.P$2 R14.P$1 R15.P$1 8.75,20.75 11.25,20.75 11.62,21.11 IC2.3
N$55
  Top 0.254: R9.P$2 R10.P$1
N$56
  Top 0.254: R18.P$2 14.12,22.65 IC2.1 14.15,21.22 14.75,20.62 R13.P$1
N$57
  Top 0.254: 18.38,19.38 20.12,19.38 IC1.3 | R7.P$1 18.38,19.38 | R3.P$2 18.38,19.38
N$58
  Top 0.254: 2.1,18.62 J1.P$1 | 2.27,18.75 J1.P$1 | R1.P$1 2.75,19 2.75,18.73 J1.P$1
N$59
  Top 0.254: 2.1,21.38 J1.P$2 2.27,21 4.88,21 R9.P$1
N$60
  Top 0.254: R16.P$2 R18.P$1 IC2.2
N$61
  Top 0.4: R31.P$2 30.25,32.88 31.38,34 X2.1
N$62
  Top 0.254: IC2.6 R8.P$1 R6.P$2
N$63  (via drill 0.4 pad 0.8)
  Top 0.254: IC5.2 v12.24,37.38 v12.25,37.38
  Bottom 0.254: v12.25,37.38 R35.P$2 R37.P$1
N$64  (via drill 0.4 pad 0.8)
  Top 0.254: v12.12,32.12 10.89,32.12 IC3.2
  Bottom 0.254: v12.12,32.12 R25.P$2 R27.P$1
V+  (via drill 0.4 pad 0.8)  (3 unrouted)
  Top 0.254: C2.P$1 C1.P$1 | 13.5,29.25 13.5,31.5 14.12,32.12 14.75,32.12 15.24,32.13 IC3.7 C16.P$1 18.5,32.12 C15.P$1 | IC4.7 28.14,34.13 C18.P$1 C17.P$1 28.25,38 C52.1 | C13.P$1 17.74,37.38
  Top 0.3: 13.5,29.25 13.88,28.88 22.5,28.88 v22.75,29.12 | v24.62,29.12 41.88,29.12 42.75,30 v42.75,35.7 42.75,38.5 42.25,39 29.25,39 28.25,38 | C14.P$1 24.88,37.38 25.25,38 C52.1
  Top 0.35: U1.3 C26.P$1 | 16.88,0.38 14.75,0.38 13.88,1.24 | C34.1 16.88,0.38 | C29.P$1 C30.P$1 27,9.5 27,10 27.88,10.88 39.62,10.88 v42.88,7.7 42.88,2.38 40.88,0.38 16.88,0.38 | C26.P$1 12.88,1.38 C25.P$1
  Top 0.4: C1.P$1 15.38,15 15.88,14.5 18.12,14.5 | 18.12,14.5 40.5,14.5 42.75,16.75 v42.75,21.7 | IC1.7 27.26,20.64 C4.P$1 C3.P$1 27.62,23.5 | C2.P$1 14.27,17.5 IC2.8 | 27.62,23.5 27.62,24.25 28.12,24.75 40.12,24.75 40.75,24.12 v40.75,22.88 | C5.1 27.62,23.5 | C6.1 18.12,14.5 | C13.P$1 C14.P$1 | 17.74,37.38 IC5.7 | C26.P$1 13.88,1.24 | IC7.7 C29.P$1 | C33.1 27,9.5 | IC11.7 C49.P$1 C48.P$1 16.5,51.5 C37.1 16.27,51.77 17.88,53.38 27.62,53.38 v29.3,51.7
  Bottom 0.254: J4.1 v42.75,35.7
  Bottom 0.3: v22.75,29.12 v24.62,29.12
  Bottom 0.4: v42.75,21.7 J2.1 arc-90 40.75,21.75 v40.75,22.88 | J5.1 v42.88,7.7 | J9.1 v29.3,51.7
V-  (via drill 0.4 pad 0.8)  (3 unrouted)
  Top 0.254: IC5.4 12.97,34.84 13.5,35.38 13.5,38.38 | 43.75,17.75 v43.75,17.7 | 20.9,39.4 21,39.62
  Top 0.3: 13.5,38.38 14.75,39.62 21,39.62 42.62,39.62 43.75,38.5 v43.75,31.7 43.75,29.75 42.38,28.38 23.62,28.38 | 11.62,29.62 12.88,28.38 23.62,28.38 | C23.P$2 23.62,28.38 | C54.2 20.9,39.4
  Top 0.35: C27.P$2 C28.P$2 U1.6 | 13.88,10.75 14.75,11.62 16.75,11.62 | C36.2 16.75,11.62 | 23.38,3 25.38,1 39.25,1 v40.75,2.5 | 16.75,11.62 40.5,11.62 43.75,8.38 v43.75,3.7
  Top 0.4: C10.P$2 21,18 | 21,18 21,18.12 | C10.P$2 22.27,16.75 C11.2 22.4,16.35 23.5,15.25 40,15.25 40.75,16 v40.75,16.5 | C9.P$2 C10.P$2 | 16.38,25.5 9.5,25.5 8.75,24.75 C7.P$2 C8.P$2 10.38,23.38 10.38,22.65 IC2.4 | 16.38,25.5 42.5,25.5 43.75,24.25 43.75,17.75 | IC1.4 20.91,18.09 21,18 | C12.2 16.25,25.38 16.38,25.5 | 9,29.62 C21.P$2 C22.P$2 9,29.59 IC3.4 11.62,29.59 11.62,29.62 | C20.P$2 C19.P$2 9,34.84 IC5.4 | IC4.4 23.28,31.59 23.62,31.25 C23.P$2 C24.P$2 | U1.6 | C28.P$2 13.88,10.75 | IC7.4 20.25,4.34 C31.P$2 C32.P$2 23,3 | 23,3 C35.2 | 23,3 23.38,3 | C50.P$2 C51.P$2 8.75,46.34 IC11.4 | C50.P$2 10,46.38 9.38,46.38 | C50.P$2 10,44.85 C38.2 11.65,44.85 13.88,42.62 27.62,42.62 v29.3,44.3
  Bottom 0.254: J4.3 v43.75,31.7
  Bottom 0.4: v43.75,17.7 J2.3 40.75,17.65 v40.75,16.5 | v43.75,3.7 J5.3 40.75,3.7 v40.75,2.5 | J9.3 v29.3,44.3

### Text on the board
Top: A | B | C | D